# Altium schematic sheet Sheet1.SchDoc
size A4
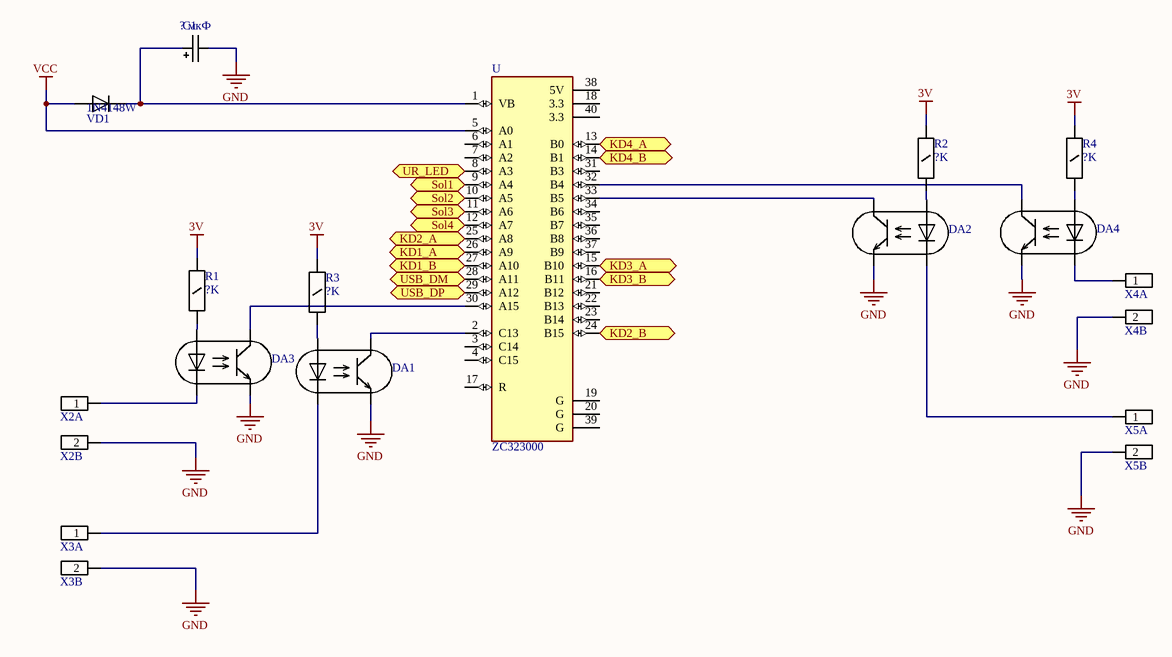
[diagram p0: Sheet1.SchDoc]

## Parts
C1  ? мкФ  [C_16x7.5]
DA1  KPC357NT  [Mini-flat-4]  (value not drawn)
DA2  KPC357NT  [Mini-flat-4]  (value not drawn)
DA3  KPC357NT  [Mini-flat-4]  (value not drawn)
DA4  KPC357NT  [Mini-flat-4]  (value not drawn)
R1  ?K  [R_1206]
R2  ?K  [R_1206]
R3  ?K  [R_1206]
R4  ?K  [R_1206]
U  ZC323000  [MODULE_ZC323000]
VD1  1N4148W  [SOD-123]
X2  DG508V-02  [DG508V-02]  (value not drawn)  (parts A,B of 2)
X3  DG508V-02  [DG508V-02]  (value not drawn)  (parts A,B of 2)
X4  DG508V-02  [DG508V-02]  (value not drawn)  (parts A,B of 2)
X5  DG508V-02  [DG508V-02]  (value not drawn)  (parts A,B of 2)

## Ports
KD1_A, KD1_B, KD2_A, KD2_B, KD3_A, KD3_B, KD4_A, KD4_B, Sol1, Sol2, Sol3, Sol4, UR_LED, USB_DM, USB_DP

## Nets
3V: R1.1 R2.1 R3.1 R4.1
GND: C1.2 DA1.3 DA2.3 DA3.3 DA4.3 X2.2 X3.2 X4.2 X5.2
VCC: U.5(A0) VD1.A
KD1_A: U.26(A9) ; port KD1_A
KD1_B: U.27(A10) ; port KD1_B
KD2_A: U.25(A8) ; port KD2_A
KD2_B: U.24(B15) ; port KD2_B
KD3_A: U.15(B10) ; port KD3_A
KD3_B: U.16(B11) ; port KD3_B
KD4_A: U.13(B0) ; port KD4_A
KD4_B: U.14(B1) ; port KD4_B
Sol1: U.9(A4) ; port Sol1
Sol2: U.10(A5) ; port Sol2
Sol3: U.11(A6) ; port Sol3
Sol4: U.12(A7) ; port Sol4
UR_LED: U.8(A3) ; port UR_LED
USB_DM: U.28(A11) ; port USB_DM
USB_DP: U.29(A12) ; port USB_DP
NetC1_1: C1.1 U.1(VB) VD1.K
NetDA1_1: DA1.1 R3.2
NetDA1_2: DA1.2 X3.1
NetDA1_4: DA1.4 U.2(C13)
NetDA2_1: DA2.1 R2.2
NetDA2_2: DA2.2 X5.1
NetDA2_4: DA2.4 U.33(B5)
NetDA3_1: DA3.1 R1.2
NetDA3_2: DA3.2 X2.1
NetDA3_4: DA3.4 U.30(A15)
NetDA4_1: DA4.1 R4.2
NetDA4_2: DA4.2 X4.1
NetDA4_4: DA4.4 U.32(B4)

Not connected (* = marked no-connect by the designer): U 3(C14) 4(C15) 6(A1) 7(A2) 17(R) 18(3.3) 19(G) 20(G) 21(B12) 22(B13) 23(B14) 31(B3) 34(B6) 35(B7) 36(B8) 37(B9) 38(5V) 39(G) 40(3.3)

## Library data of the parts
C1 = Конденсатор 16х7.5: К50-35; Tolerance: 20%; Type: Электролитический конденсатор; Life: 2000 часов; Name: К50-35; Value: ? мкФ; Mounting: в отверстие
DA1-DA4 = KPC357NT: оптрон, SMD; Name: KPC357NT; Mounting: SMD
R1-R4 = Резистор 1206: 0,25 Вт; Name: 1206; Power: 0.25 Вт; Tolerance: 5%; Voltage: 200В; Type: Резистор ЧИП; Value: ?K; Mounting: SMD
U = ZC323000: STM32F103C8T6 ARM STM32 Minimum System Development Board Module For Arduino; MF: YKS; Package: None; Availability: Unavailable; MP: ZC323000; SnapEDA_Link: https://www.snapeda.com/parts/ZC323000/YKS/view-part/725364/?ref=snap; Value: *; Price: None
VD1 = 1N4148W: диод, SMD; Max current: 150 mA; Drop voltage: 1.25 В; Max voltage: 100 В; Power: 410 мВт; Name: 1N4148W; Mounting: SMD; Temperature: -65 .. +150
X2-X5 = DG508V-02: клеммник винтовой 2к.,5.08мм; Analog: MKDS 2/3; Name: DG508V-02; Type: шаг 5,08 мм; Mounting: в отверстие